# Altium schematic sheet Main.SchDoc
size A2
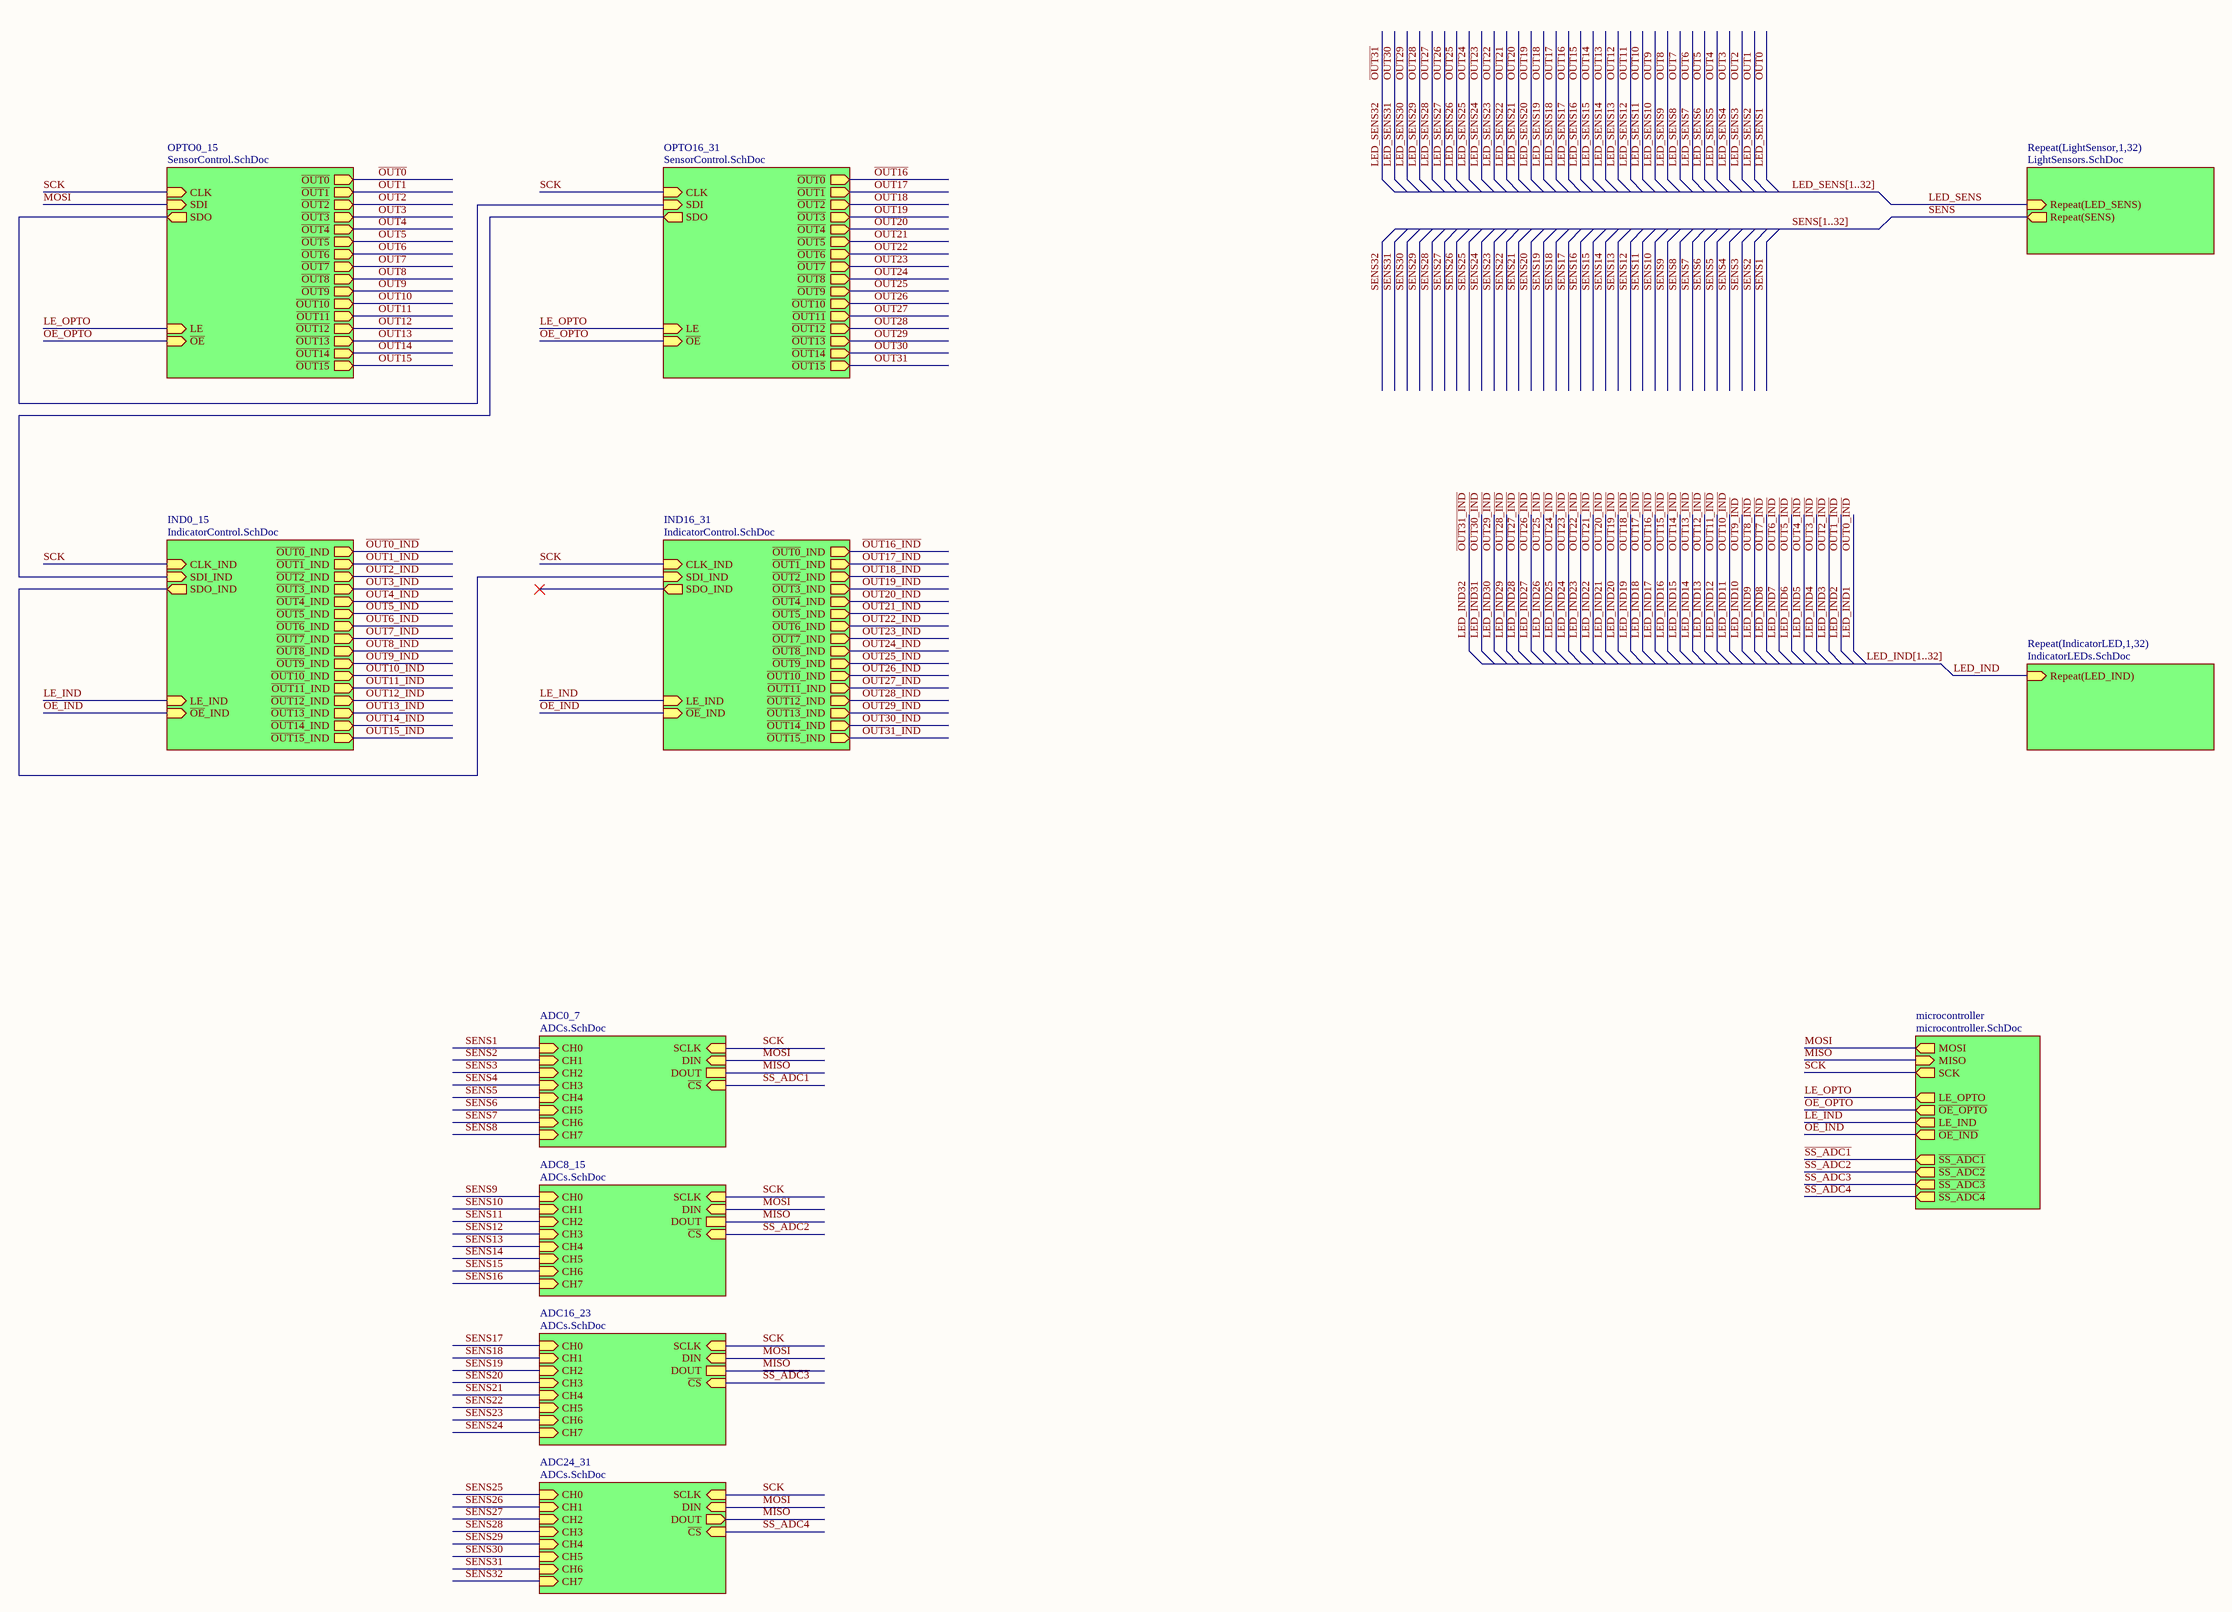
[diagram p0: Main.SchDoc]

## Sub-sheets
ADC0_7 = ADCs.SchDoc: CH0 (in), CH1 (in), CH2 (in), CH3 (in), CH4 (in), CH5 (in), CH6 (in), CH7 (in), SCLK (in), ~{CS} (in), DIN (in), DOUT
ADC8_15 = ADCs.SchDoc: CH0 (in), CH1 (in), CH2 (in), CH3 (in), CH4 (in), CH5 (in), CH6 (in), CH7 (in), SCLK (in), ~{CS} (in), DIN (in), DOUT
ADC16_23 = ADCs.SchDoc: CH0 (in), CH1 (in), CH2 (in), CH3 (in), CH4 (in), CH5 (in), CH6 (in), CH7 (in), SCLK (in), ~{CS} (in), DIN (in), DOUT
ADC24_31 = ADCs.SchDoc: CH0 (in), CH1 (in), CH2 (in), CH3 (in), CH4 (in), CH5 (in), CH6 (in), CH7 (in), SCLK (in), ~{CS} (in), DIN (in), DOUT (out)
IND0_15 = IndicatorControl.SchDoc: ~{OUT0}_IND (out), ~{OUT1}_IND (out), ~{OUT2}_IND (out), ~{OUT3}_IND (out), ~{OUT4}_IND (out), ~{OUT5}_IND (out), ~{OUT6}_IND (out), ~{OUT7}_IND (out), ~{OUT8}_IND (out), ~{OUT9}_IND (out), ~{OUT10}_IND (out), ~{OUT11}_IND (out), ~{OUT12}_IND (out), ~{OUT13}_IND (out), ~{OUT14}_IND (out), ~{OUT15}_IND (out), SDI_IND (in), ~{OE}_IND (in), CLK_IND (in), LE_IND (in), SDO_IND (out)
IND16_31 = IndicatorControl.SchDoc: ~{OUT0}_IND (out), ~{OUT1}_IND (out), ~{OUT2}_IND (out), ~{OUT3}_IND (out), ~{OUT4}_IND (out), ~{OUT5}_IND (out), ~{OUT6}_IND (out), ~{OUT7}_IND (out), ~{OUT8}_IND (out), ~{OUT9}_IND (out), ~{OUT10}_IND (out), ~{OUT11}_IND (out), ~{OUT12}_IND (out), ~{OUT13}_IND (out), ~{OUT14}_IND (out), ~{OUT15}_IND (out), SDI_IND (in), ~{OE}_IND (in), CLK_IND (in), LE_IND (in), SDO_IND (out)
microcontroller = microcontroller.SchDoc: LE_IND (out), ~{OE_IND} (out), ~{SS_ADC4} (out), LE_OPTO (out), ~{SS_ADC3} (out), MOSI (out), SCK (out), ~{OE_OPTO} (out), ~{SS_ADC1} (out), ~{SS_ADC2} (out), MISO (in)
OPTO0_15 = SensorControl.SchDoc: ~{OUT0} (out), ~{OUT1} (out), ~{OUT2} (out), ~{OUT3} (out), ~{OUT4} (out), ~{OUT5} (out), ~{OUT6} (out), ~{OUT7} (out), ~{OUT8} (out), ~{OUT9} (out), ~{OUT10} (out), ~{OUT11} (out), ~{OUT12} (out), ~{OUT13} (out), ~{OUT14} (out), ~{OUT15} (out), SDI (in), ~{OE} (in), CLK (in), LE (in), SDO (out)
OPTO16_31 = SensorControl.SchDoc: ~{OUT0} (out), ~{OUT1} (out), ~{OUT2} (out), ~{OUT3} (out), ~{OUT4} (out), ~{OUT5} (out), ~{OUT6} (out), ~{OUT7} (out), ~{OUT8} (out), ~{OUT9} (out), ~{OUT10} (out), ~{OUT11} (out), ~{OUT12} (out), ~{OUT13} (out), ~{OUT14} (out), ~{OUT15} (out), SDI (in), ~{OE} (in), CLK (in), LE (in), SDO (out)
Repeat(IndicatorLED,1,32) = IndicatorLEDs.SchDoc: Repeat(LED_IND) (in)
Repeat(LightSensor,1,32) = LightSensors.SchDoc: Repeat(SENS) (out), Repeat(LED_SENS) (in)

## Nets
LE_IND: sheet IND0_15/LE_IND, sheet IND16_31/LE_IND, sheet microcontroller/LE_IND
LE_OPTO: sheet OPTO0_15/LE, sheet OPTO16_31/LE, sheet microcontroller/LE_OPTO
LED_IND: sheet Repeat(IndicatorLED,1,32)/Repeat(LED_IND)
LED_IND1: sheet IND0_15/~{OUT0}_IND  [also labelled ~{OUT0_IND}]
LED_IND2: sheet IND0_15/~{OUT1}_IND  [also labelled ~{OUT1_IND}]
LED_IND3: sheet IND0_15/~{OUT2}_IND  [also labelled ~{OUT2_IND}]
LED_IND4: sheet IND0_15/~{OUT3}_IND  [also labelled ~{OUT3_IND}]
LED_IND5: sheet IND0_15/~{OUT4}_IND  [also labelled ~{OUT4_IND}]
LED_IND6: sheet IND0_15/~{OUT5}_IND  [also labelled ~{OUT5_IND}]
LED_IND7: sheet IND0_15/~{OUT6}_IND  [also labelled ~{OUT6_IND}]
LED_IND8: sheet IND0_15/~{OUT7}_IND  [also labelled ~{OUT7_IND}]
LED_IND9: sheet IND0_15/~{OUT8}_IND  [also labelled ~{OUT8_IND}]
LED_IND10: sheet IND0_15/~{OUT9}_IND  [also labelled ~{OUT9_IND}]
LED_IND11: sheet IND0_15/~{OUT10}_IND  [also labelled ~{OUT10_IND}]
LED_IND12: sheet IND0_15/~{OUT11}_IND  [also labelled ~{OUT11_IND}]
LED_IND13: sheet IND0_15/~{OUT12}_IND  [also labelled ~{OUT12_IND}]
LED_IND14: sheet IND0_15/~{OUT13}_IND  [also labelled ~{OUT13_IND}]
LED_IND15: sheet IND0_15/~{OUT14}_IND  [also labelled ~{OUT14_IND}]
LED_IND16: sheet IND0_15/~{OUT15}_IND  [also labelled ~{OUT15_IND}]
LED_IND17: sheet IND16_31/~{OUT0}_IND  [also labelled ~{OUT16_IND}]
LED_IND18: sheet IND16_31/~{OUT1}_IND  [also labelled ~{OUT17_IND}]
LED_IND19: sheet IND16_31/~{OUT2}_IND  [also labelled ~{OUT18_IND}]
LED_IND20: sheet IND16_31/~{OUT3}_IND  [also labelled ~{OUT19_IND}]
LED_IND21: sheet IND16_31/~{OUT4}_IND  [also labelled ~{OUT20_IND}]
LED_IND22: sheet IND16_31/~{OUT5}_IND  [also labelled ~{OUT21_IND}]
LED_IND23: sheet IND16_31/~{OUT6}_IND  [also labelled ~{OUT22_IND}]
LED_IND24: sheet IND16_31/~{OUT7}_IND  [also labelled ~{OUT23_IND}]
LED_IND25: sheet IND16_31/~{OUT8}_IND  [also labelled ~{OUT24_IND}]
LED_IND26: sheet IND16_31/~{OUT9}_IND  [also labelled ~{OUT25_IND}]
LED_IND27: sheet IND16_31/~{OUT10}_IND  [also labelled ~{OUT26_IND}]
LED_IND28: sheet IND16_31/~{OUT11}_IND  [also labelled ~{OUT27_IND}]
LED_IND29: sheet IND16_31/~{OUT12}_IND  [also labelled ~{OUT28_IND}]
LED_IND30: sheet IND16_31/~{OUT13}_IND  [also labelled ~{OUT29_IND}]
LED_IND31: sheet IND16_31/~{OUT14}_IND  [also labelled ~{OUT30_IND}]
LED_IND32: sheet IND16_31/~{OUT15}_IND  [also labelled ~{OUT31_IND}]
LED_SENS: sheet Repeat(LightSensor,1,32)/Repeat(LED_SENS)
LED_SENS1: sheet OPTO0_15/~{OUT0}  [also labelled ~{OUT0}]
LED_SENS2: sheet OPTO0_15/~{OUT1}  [also labelled ~{OUT1}]
LED_SENS3: sheet OPTO0_15/~{OUT2}  [also labelled ~{OUT2}]
LED_SENS4: sheet OPTO0_15/~{OUT3}  [also labelled ~{OUT3}]
LED_SENS5: sheet OPTO0_15/~{OUT4}  [also labelled ~{OUT4}]
LED_SENS6: sheet OPTO0_15/~{OUT5}  [also labelled ~{OUT5}]
LED_SENS7: sheet OPTO0_15/~{OUT6}  [also labelled ~{OUT6}]
LED_SENS8: sheet OPTO0_15/~{OUT7}  [also labelled ~{OUT7}]
LED_SENS9: sheet OPTO0_15/~{OUT8}  [also labelled ~{OUT8}]
LED_SENS10: sheet OPTO0_15/~{OUT9}  [also labelled ~{OUT9}]
LED_SENS11: sheet OPTO0_15/~{OUT10}  [also labelled ~{OUT10}]
LED_SENS12: sheet OPTO0_15/~{OUT11}  [also labelled ~{OUT11}]
LED_SENS13: sheet OPTO0_15/~{OUT12}  [also labelled ~{OUT12}]
LED_SENS14: sheet OPTO0_15/~{OUT13}  [also labelled ~{OUT13}]
LED_SENS15: sheet OPTO0_15/~{OUT14}  [also labelled ~{OUT14}]
LED_SENS16: sheet OPTO0_15/~{OUT15}  [also labelled ~{OUT15}]
LED_SENS17: sheet OPTO16_31/~{OUT0}  [also labelled ~{OUT16}]
LED_SENS18: sheet OPTO16_31/~{OUT1}  [also labelled ~{OUT17}]
LED_SENS19: sheet OPTO16_31/~{OUT2}  [also labelled ~{OUT18}]
LED_SENS20: sheet OPTO16_31/~{OUT3}  [also labelled ~{OUT19}]
LED_SENS21: sheet OPTO16_31/~{OUT4}  [also labelled ~{OUT20}]
LED_SENS22: sheet OPTO16_31/~{OUT5}  [also labelled ~{OUT21}]
LED_SENS23: sheet OPTO16_31/~{OUT6}  [also labelled ~{OUT22}]
LED_SENS24: sheet OPTO16_31/~{OUT7}  [also labelled ~{OUT23}]
LED_SENS25: sheet OPTO16_31/~{OUT8}  [also labelled ~{OUT24}]
LED_SENS26: sheet OPTO16_31/~{OUT9}  [also labelled ~{OUT25}]
LED_SENS27: sheet OPTO16_31/~{OUT10}  [also labelled ~{OUT26}]
LED_SENS28: sheet OPTO16_31/~{OUT11}  [also labelled ~{OUT27}]
LED_SENS29: sheet OPTO16_31/~{OUT12}  [also labelled ~{OUT28}]
LED_SENS30: sheet OPTO16_31/~{OUT13}  [also labelled ~{OUT29}]
LED_SENS31: sheet OPTO16_31/~{OUT14}  [also labelled ~{OUT30}]
LED_SENS32: sheet OPTO16_31/~{OUT15}  [also labelled ~{OUT31}]
MISO: sheet microcontroller/MISO, sheet ADC0_7/DOUT, sheet ADC8_15/DOUT, sheet ADC16_23/DOUT, sheet ADC24_31/DOUT
MOSI: sheet OPTO0_15/SDI, sheet microcontroller/MOSI, sheet ADC0_7/DIN, sheet ADC8_15/DIN, sheet ADC16_23/DIN, sheet ADC24_31/DIN
~{OE_IND}: sheet IND0_15/~{OE}_IND, sheet IND16_31/~{OE}_IND, sheet microcontroller/~{OE_IND}
~{OE_OPTO}: sheet OPTO0_15/~{OE}, sheet OPTO16_31/~{OE}, sheet microcontroller/~{OE_OPTO}
~{SS_ADC1}: sheet microcontroller/~{SS_ADC1}, sheet ADC0_7/~{CS}
~{SS_ADC2}: sheet microcontroller/~{SS_ADC2}, sheet ADC8_15/~{CS}
~{SS_ADC3}: sheet microcontroller/~{SS_ADC3}, sheet ADC16_23/~{CS}
~{SS_ADC4}: sheet microcontroller/~{SS_ADC4}, sheet ADC24_31/~{CS}
SCK: sheet OPTO0_15/CLK, sheet OPTO16_31/CLK, sheet IND0_15/CLK_IND, sheet IND16_31/CLK_IND, sheet microcontroller/SCK, sheet ADC0_7/SCLK, sheet ADC8_15/SCLK, sheet ADC16_23/SCLK, sheet ADC24_31/SCLK
SENS: sheet Repeat(LightSensor,1,32)/Repeat(SENS)
SENS1: sheet ADC0_7/CH0
SENS2: sheet ADC0_7/CH1
SENS3: sheet ADC0_7/CH2
SENS4: sheet ADC0_7/CH3
SENS5: sheet ADC0_7/CH4
SENS6: sheet ADC0_7/CH5
SENS7: sheet ADC0_7/CH6
SENS8: sheet ADC0_7/CH7
SENS9: sheet ADC8_15/CH0
SENS10: sheet ADC8_15/CH1
SENS11: sheet ADC8_15/CH2
SENS12: sheet ADC8_15/CH3
SENS13: sheet ADC8_15/CH4
SENS14: sheet ADC8_15/CH5
SENS15: sheet ADC8_15/CH6
SENS16: sheet ADC8_15/CH7
SENS17: sheet ADC16_23/CH0
SENS18: sheet ADC16_23/CH1
SENS19: sheet ADC16_23/CH2
SENS20: sheet ADC16_23/CH3
SENS21: sheet ADC16_23/CH4
SENS22: sheet ADC16_23/CH5
SENS23: sheet ADC16_23/CH6
SENS24: sheet ADC16_23/CH7
SENS25: sheet ADC24_31/CH0
SENS26: sheet ADC24_31/CH1
SENS27: sheet ADC24_31/CH2
SENS28: sheet ADC24_31/CH3
SENS29: sheet ADC24_31/CH4
SENS30: sheet ADC24_31/CH5
SENS31: sheet ADC24_31/CH6
SENS32: sheet ADC24_31/CH7
(unnamed): sheet OPTO0_15/SDO, sheet OPTO16_31/SDI
(unnamed): sheet OPTO16_31/SDO, sheet IND0_15/SDI_IND
(unnamed): sheet IND0_15/SDO_IND, sheet IND16_31/SDI_IND

## Buses and harness runs
bus LED_IND[1..32]
bus LED_SENS[1..32]
bus SENS[1..32]